# Altium schematic sheet MICmuter_v2.SchDoc
size A4
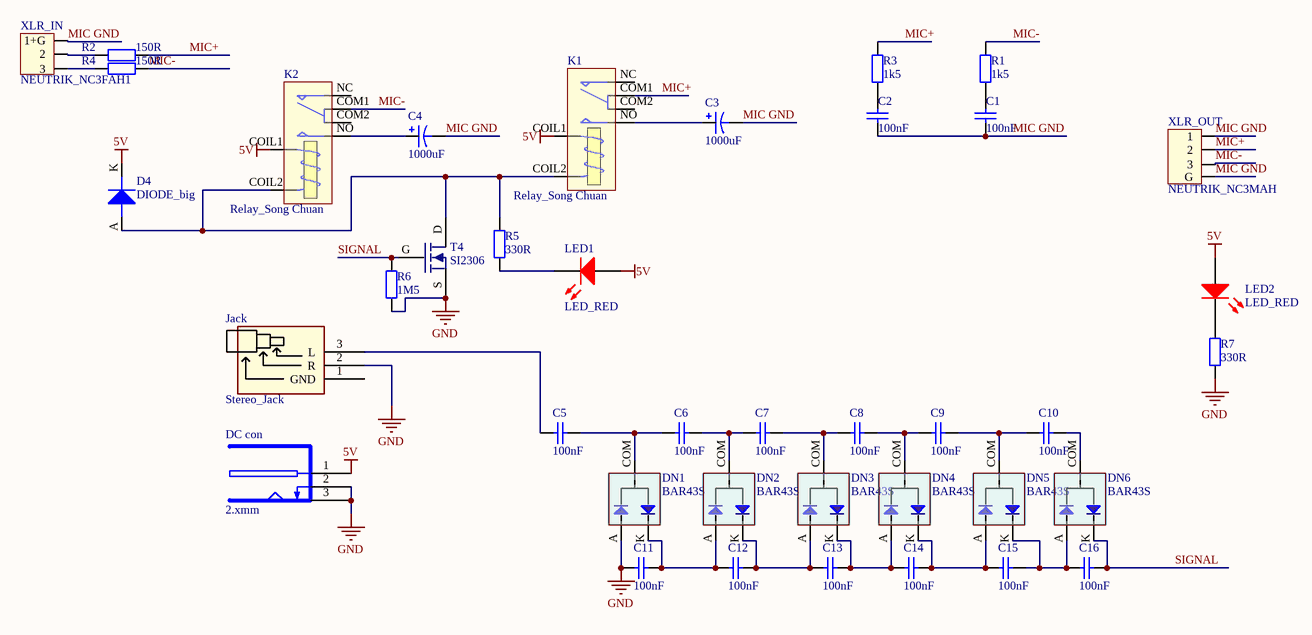
[diagram p0: MICmuter_v2.SchDoc]

## Parts
C1  100nF  [FP_0603_CAP_080]
C2  100nF  [FP_0603_CAP_080]
C3  1000uF  [CAP_8x11_allo]
C4  1000uF  [CAP_8x11_allo]
C5  100nF  [FP_0603_CAP_080]
C6  100nF  [FP_0603_CAP_080]
C7  100nF  [FP_0603_CAP_080]
C8  100nF  [FP_0603_CAP_080]
C9  100nF  [FP_0603_CAP_080]
C10  100nF  [FP_0603_CAP_080]
C11  100nF  [FP_0603_CAP_080]
C12  100nF  [FP_0603_CAP_080]
C13  100nF  [FP_0603_CAP_080]
C14  100nF  [FP_0603_CAP_080]
C15  100nF  [FP_0603_CAP_080]
C16  100nF  [FP_0603_CAP_080]
D4  DIODE_big  [FP_SMA DO214AC]
DC_con  2.xmm  [FP_DC_TAP_ANYA]
DN1  BAR43S  [DIODE_SOT23_serial]
DN2  BAR43S  [DIODE_SOT23_serial]
DN3  BAR43S  [DIODE_SOT23_serial]
DN4  BAR43S  [DIODE_SOT23_serial]
DN5  BAR43S  [DIODE_SOT23_serial]
DN6  BAR43S  [DIODE_SOT23_serial]
Jack  Stereo_Jack  [STEREO_JACK]
K1  Relay_Song Chuan  [Relay_Song Chuan]
K2  Relay_Song Chuan  [Relay_Song Chuan]
LED1  LED_RED  [Osram sideled]
LED2  LED_RED  [Osram sideled]
R1  1k5  [FP_0603_RES]
R2  150R  [FP_0603_RES]
R3  1k5  [FP_0603_RES]
R4  150R  [FP_0603_RES]
R5  330R  [FP_0603_RES]
R6  1M5  [FP_0603_RES]
R7  330R  [FP_0603_RES]
T4  SI2306  [FET_SOT23]
XLR_IN  NEUTRIK_NC3FAH1  [NEUTRIK_NC3FAH1]
XLR_OUT  NEUTRIK_NC3MAH  [NEUTRIK_NC3MAH]

## Nets
5V: D4.K DC_con.1(9V) K1.COIL1 K2.COIL1 LED1.A LED2.A
GND: C11.2 DC_con.2(GND) DC_con.3(GND) DN1.A Jack.2(R) R6.2 R7.2 T4.S
MIC GND: C1.1 C2.1 C3.N C4.N XLR_IN.1+G XLR_OUT.1 XLR_OUT.G
MIC+: K1.COM1(COM) R2.1 R3.1 XLR_OUT.2
MIC-: K2.COM1(COM) R1.1 R4.1 XLR_OUT.3
SIGNAL: C16.1 DN6.K R6.1 T4.G
NetC1_2: C1.2 R1.2
NetC2_2: C2.2 R3.2
NetC3_P: C3.P K1.NO
NetC4_P: C4.P K2.NO
NetC5_1: C5.1 C6.2 DN1.COM
NetC5_2: C5.2 Jack.3(L)
NetC6_1: C6.1 C7.2 DN2.COM
NetC7_1: C7.1 C8.2 DN3.COM
NetC8_1: C8.1 C9.2 DN4.COM
NetC9_1: C9.1 C10.2 DN5.COM
NetC10_1: C10.1 DN6.COM
NetC11_1: C11.1 C12.2 DN1.K DN2.A
NetC12_1: C12.1 C13.2 DN2.K DN3.A
NetC13_1: C13.1 C14.2 DN3.K DN4.A
NetC14_1: C14.1 C15.2 DN4.K DN5.A
NetC15_1: C15.1 C16.2 DN5.K DN6.A
NetD4_A: D4.A K1.COIL2 K2.COIL2 R5.1 T4.D
NetLED1_K: LED1.K R5.2
NetLED2_K: LED2.K R7.1
NetR2_2: R2.2 XLR_IN.2
NetR4_2: R4.2 XLR_IN.3

Not connected (* = marked no-connect by the designer): Jack 1(GND); K1 COM2(COM) NC; K2 COM2(COM) NC

## Library data of the parts
C1 C2 C5-C16 = CAP: Capacitor; Tűrés: 10%; Value: 100nF; Order info: 82-04-85
C3 C4 = CAP_ELECT: Polarized Capacitor; Value: 1000uF; Order info: 12-19-15
D4 = DIODE_big: Order info: lomex: 83-02-56
DC_con = DC_TAP_ANYA: 2.xmm DC HEBA25 TÁPFESZÜLTSÉG ALJZAT ZÁRT, NYÁKBA 90°; Order info: Lomex 43-07-67
Jack = Stereo_Jack: Order info: lomex: 43-08-39
K1 K2 = Relay_Song Chuan: SPDT Relay; Published: 8-Jun-2000; LatestRevisionDate: 17-Jul-2002; LatestRevisionNote: Re-released for DXP Platform.; PackageReference: MODULE5B; Publisher: Altium Limited; Order info: 42-16-40
LED1 LED2 = LED_R: Typical LED; Order info: http://www.newark.com/osram/lwa67c-t2u2-5k8l-z/led-white-2-4mm-710mcd/dp/05M0588
R1-R7 = Res3: Resistor; Tűrés: 5%
  R1 R3: Value: 1k5; Order info: 81-10-28
  R2 R4: Value: 150R; Order info: 81-10-17
  R5 R7: Value: 330R; Order info: 81-17-48
  R6: Value: 1M5; Order info: 81-12-96
T4 = NMOS: Order info: 86-01-57
DN1-DN6 = BAR43S: Order info: 83-01-05
XLR_IN = NEUTRIK_NC3FAH1: Order info: NEUTRIK_NC3FAH1
XLR_OUT = NEUTRIK_NC3MAH: Order info: NEUTRIK_NC3MAH